# Altium project ArduinoShieldADC.PrjPcb
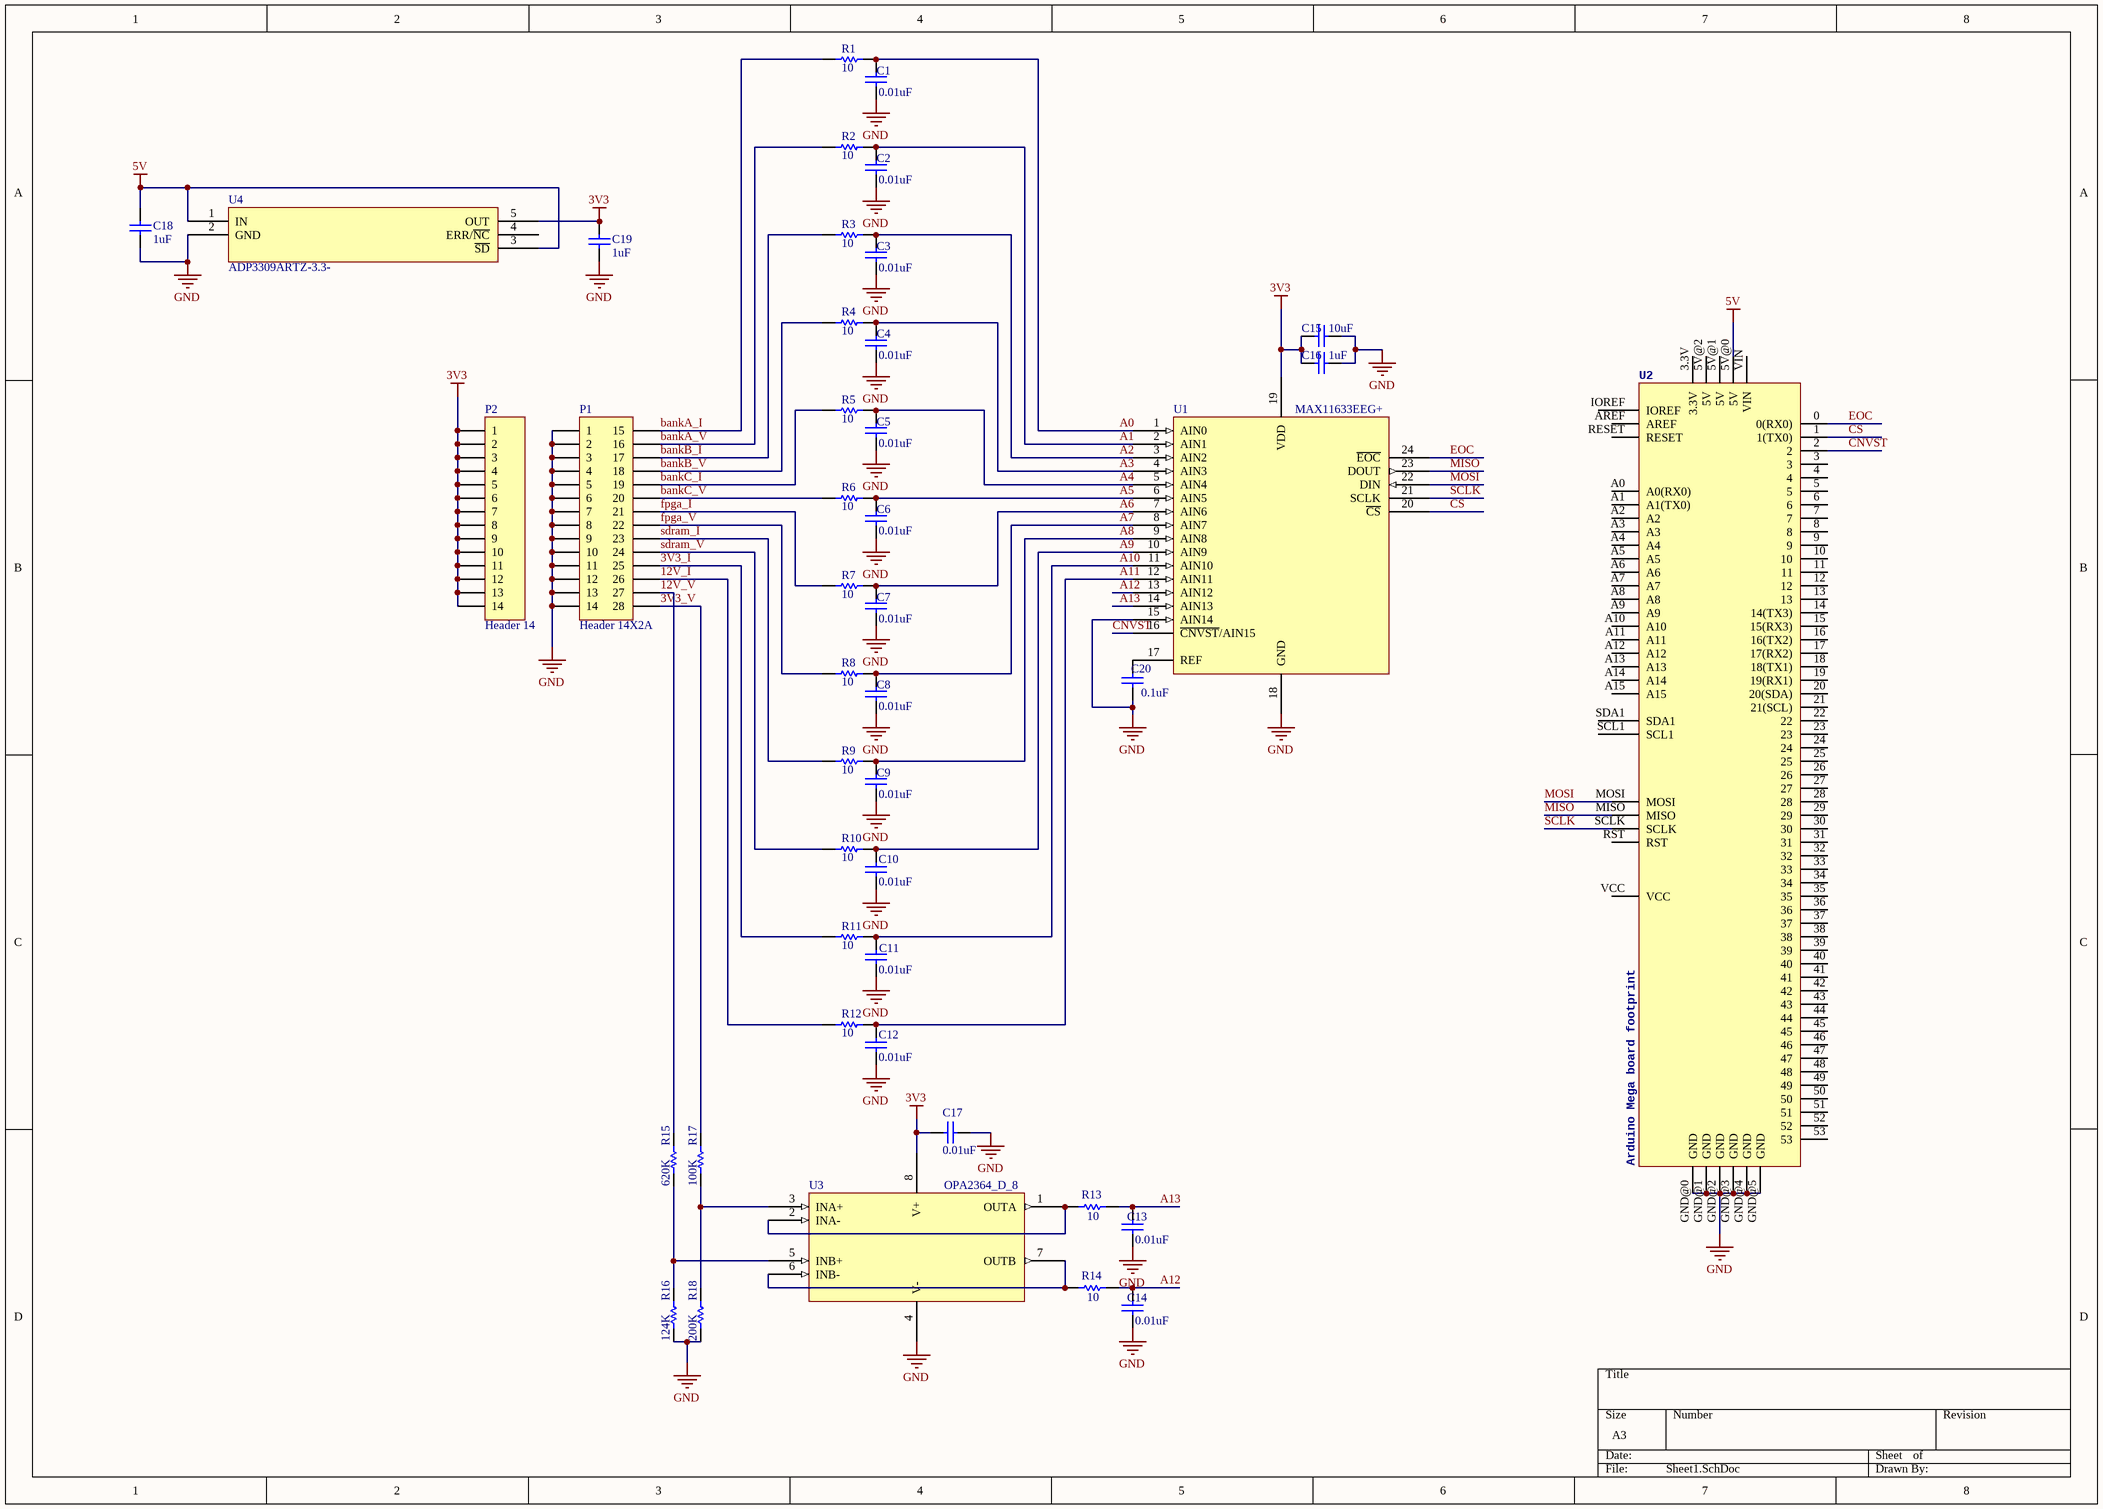
[diagram p0: Sheet1.SchDoc]
1 sheet, 44 parts. Net scope: global (net labels, ports and power ports of the same name join across sheets).
Board file: ArduinoShieldADC.PcbDoc

## Sheet Sheet1.SchDoc
size A3

### Parts
C1  value 0.01uF  [1608[0603]]  (hidden comment: Cap Semi)
C2  value 0.01uF  [1608[0603]]  (hidden comment: Cap Semi)
C3  value 0.01uF  [1608[0603]]  (hidden comment: Cap Semi)
C4  value 0.01uF  [1608[0603]]  (hidden comment: Cap Semi)
C5  value 0.01uF  [1608[0603]]  (hidden comment: Cap Semi)
C6  value 0.01uF  [1608[0603]]  (hidden comment: Cap Semi)
C7  value 0.01uF  [1608[0603]]  (hidden comment: Cap Semi)
C8  value 0.01uF  [1608[0603]]  (hidden comment: Cap Semi)
C9  value 0.01uF  [1608[0603]]  (hidden comment: Cap Semi)
C10  value 0.01uF  [1608[0603]]  (hidden comment: Cap Semi)
C11  value 0.01uF  [1608[0603]]  (hidden comment: Cap Semi)
C12  value 0.01uF  [1608[0603]]  (hidden comment: Cap Semi)
C13  value 0.01uF  [1608[0603]]  (hidden comment: Cap Semi)
C14  value 0.01uF  [1608[0603]]  (hidden comment: Cap Semi)
C15  value 10uF  [C1210_N]  (hidden comment: Cap Semi)
C16  value 1uF  [1608[0603]]  (hidden comment: Cap Semi)
C17  value 0.01uF  [1608[0603]]  (hidden comment: Cap Semi)
C18  value 1uF  [1608[0603]]  (hidden comment: Cap Semi)
C19  value 1uF  [1608[0603]]  (hidden comment: Cap Semi)
C20  value 0.1uF  [1608[0603]]  (hidden comment: Cap Semi)
P1  Header 14X2A  [HDR2X14_CEN]
P2  Header 14  [HDR1X14]
R1  value 10  [J1-0603]  (hidden comment: Res Semi)
R2  value 10  [J1-0603]  (hidden comment: Res Semi)
R3  value 10  [J1-0603]  (hidden comment: Res Semi)
R4  value 10  [J1-0603]  (hidden comment: Res Semi)
R5  value 10  [J1-0603]  (hidden comment: Res Semi)
R6  value 10  [J1-0603]  (hidden comment: Res Semi)
R7  value 10  [J1-0603]  (hidden comment: Res Semi)
R8  value 10  [J1-0603]  (hidden comment: Res Semi)
R9  value 10  [J1-0603]  (hidden comment: Res Semi)
R10  value 10  [J1-0603]  (hidden comment: Res Semi)
R11  value 10  [J1-0603]  (hidden comment: Res Semi)
R12  value 10  [J1-0603]  (hidden comment: Res Semi)
R13  value 10  [J1-0603]  (hidden comment: Res Semi)
R14  value 10  [J1-0603]  (hidden comment: Res Semi)
R15  value 620K  [J1-0603]  (hidden comment: Res Semi)
R16  value 124K  [J1-0603]  (hidden comment: Res Semi)
R17  value 100K  [J1-0603]  (hidden comment: Res Semi)
R18  value 200K  [J1-0603]  (hidden comment: Res Semi)
U1  MAX11633EEG+  [21-0055H_24]
U2  Arduino Mega board footprint  [ARDUINO_MEGA-PRO-3.3V]
U3  OPA2364_D_8  [D8]
U4  ADP3309ARTZ-3.3-  [RJ_5-M]

### Nets
3V3: C15.2 C16.2 C17.2 C19.1 P2.1 P2.2 P2.3 P2.4 P2.5 P2.6 P2.7 P2.8 P2.9 P2.10 P2.11 P2.12 P2.13 P2.14 U1.19(VDD) U3.8(V+) U4.5(OUT)
5V: C18.1 U2.5V@0(5V) U4.1(IN) U4.3(~{SD})
GND: C1.1 C2.1 C3.1 C4.1 C5.1 C6.1 C7.1 C8.1 C9.1 C10.1 C11.1 C12.1 C13.1 C14.1 C15.1 C16.1 C17.1 C18.2 C19.2 C20.1 P1.1 P1.2 P1.3 P1.4 P1.5 P1.6 P1.7 P1.8 P1.9 P1.10 P1.11 P1.12 P1.13 P1.14 R16.1 R18.1 U1.15(AIN14) U1.18(GND) U2.GND@0(GND) U2.GND@1(GND) U2.GND@2(GND) U2.GND@3(GND) U2.GND@4(GND) U2.GND@5(GND) U3.4(V-) U4.2(GND)
3V3_I: P1.25 R11.2
3V3_V: P1.28 R17.2
12V_I: P1.26 R12.2
12V_V: P1.27 R15.2
A0: C1.2 R1.1 U1.1(AIN0)
A1: C2.2 R2.1 U1.2(AIN1)
A2: C3.2 R3.1 U1.3(AIN2)
A3: C4.2 R4.1 U1.4(AIN3)
A4: C5.2 R5.1 U1.5(AIN4)
A5: C6.2 R6.1 U1.6(AIN5)
A6: C7.2 R7.1 U1.7(AIN6)
A7: C8.2 R8.1 U1.8(AIN7)
A8: C9.2 R9.1 U1.9(AIN8)
A9: C10.2 R10.1 U1.10(AIN9)
A10: C11.2 R11.1 U1.11(AIN10)
A11: C12.2 R12.1 U1.12(AIN11)
A12: C14.2 R14.1 U1.13(AIN12)
A13: C13.2 R13.1 U1.14(AIN13)
bankA_I: P1.15 R1.2
bankA_V: P1.16 R2.2
bankB_I: P1.17 R3.2
bankB_V: P1.18 R4.2
bankC_I: P1.19 R5.2
bankC_V: P1.20 R6.2
CNVST: U1.16(~{CNVST}/AIN15) U2.2
CS: U1.20(~{CS}) U2.1(1(TX0))
EOC: U1.24(~{EOC}) U2.0(0(RX0))
fpga_I: P1.21 R7.2
fpga_V: P1.22 R8.2
MISO: U1.23(DOUT) U2.MISO
MOSI: U1.22(DIN) U2.MOSI
SCLK: U1.21(SCLK) U2.SCLK
sdram_I: P1.23 R9.2
sdram_V: P1.24 R10.2
NetC20_2: C20.2 U1.17(REF)
NetR13_2: R13.2 U3.1(OUTA) U3.2(INA-)
NetR14_2: R14.2 U3.6(INB-) U3.7(OUTB)
NetR15_1: R15.1 R16.2 U3.5(INB+)
NetR17_1: R17.1 R18.2 U3.3(INA+)

Not connected (* = marked no-connect by the designer): U2 3 3.3V 4 5 5V@1(5V) 5V@2(5V) 6 7 8 9 10 11 12 13 14(14(TX3)) 15(15(RX3)) 16(16(TX2)) 17(17(RX2)) 18(18(TX1)) 19(19(RX1)) 20(20(SDA)) 21(21(SCL)) 22 23 24 25 26 27 28 29 30 31 32 33 34 35 36 37 38 39 40 41 42 43 44 45 46 47 48 49 50 51 52 53 A0(A0(RX0)) A1(A1(TX0)) A2 A3 A4 A5 A6 A7 A8 A9 A10 A11 A12 A13 A14 A15 AREF IOREF RESET RST SCL1 SDA1 VCC VIN; U4 4(ERR/~{NC})

### Library data of the parts
C1-C20 = Cap Semi: Capacitor (Semiconductor SIM Model); Published: 8-Jun-2000; LatestRevisionDate: 29-May-2009; LatestRevisionNote: IPC-7351 Footprint Added.; PackageReference: C1206; Publisher: Altium Limited; PackageDescription: Chip Capacitor
P1 = Header 14X2A: Header, 14-Pin, Dual row; LatestRevisionDate: 17-Jul-2002; LatestRevisionNote: Re-released for DXP Platform.; Publisher: Altium Limited
P2 = Header 14: Header, 14-Pin; LatestRevisionDate: 17-Jul-2002; LatestRevisionNote: Re-released for DXP Platform.; Publisher: Altium Limited
R1-R18 = Res Semi: Semiconductor Resistor; Published: 8-Jun-2000; LatestRevisionDate: 17-Jul-2002; LatestRevisionNote: Re-released for DXP Platform.; PackageReference: AXIAL-0.5; Publisher: Altium Limited; PackageDescription: Axial Device, Thru-Hole; 2 Leads; 0.5 in Pin Spacing
U1 = MAX11633EEG+: Imported; Vendor: MAXIM; Manufacturer_Part_Number: MAX11633EEG+; Manufacturer_Name: Maxim; RefDes: RefDes; Type: DEV; Value: Value
U2 = ARDUINO-MEGAPRO
U3 = OPA2364_D_8: Imported; Manufacturer: Texas Instruments; INDUSTRY_STD_PKG_TYPE: SOIC; FAMILY_NAME: WIDE BANDWIDTH; PIN_COUNT: 8; PACKAGE_DESIGNATOR: D; Datasheet URL: http://www.ti.com/lit/gpn/OPA2364; GENERIC_PART_NUMBER: OPA2364; Vendor: Texas Instruments; Manufacturer_Part_Number: opa2364_d_8; RefDes: RefDes; Type: DEV; Value: Value
U4 = ADP3309ARTZ-3.3-: Imported; Manufacturer_Part_Number: ADP3309ARTZ-3.3-R7; Vendor: Analog Devices Inc; Regulator Topology: Positive Fixed; Voltage - Output: 3.3V; Voltage - Input: Up to 12V; Voltage - Dropout (Typical): 0.12V @ 100mA; Number of Regulators: 1; Current - Output: 100mA; DigiKeyPartNumber: ADP3309ARTZ-3.3-R7TR-ND; Quantity_Available: 6000; DataSheet: http://www.analog.com/static/imported-files/data_sheets/ADP3309.pdf; Current - Limit (Min): -; Operating Temperature: -20Â°C ~ 85Â°C; Mounting Type: Surface Mount; Package / Case: SC-74A, SOT-753; Supplier Device Package: SOT-23-5; Packaging: Tape &amp; Reel (TR); RefDes: RefDes; Type: DEV; Value: Value